# Altium schematic sheet DriverPCB.SchDoc
size A1
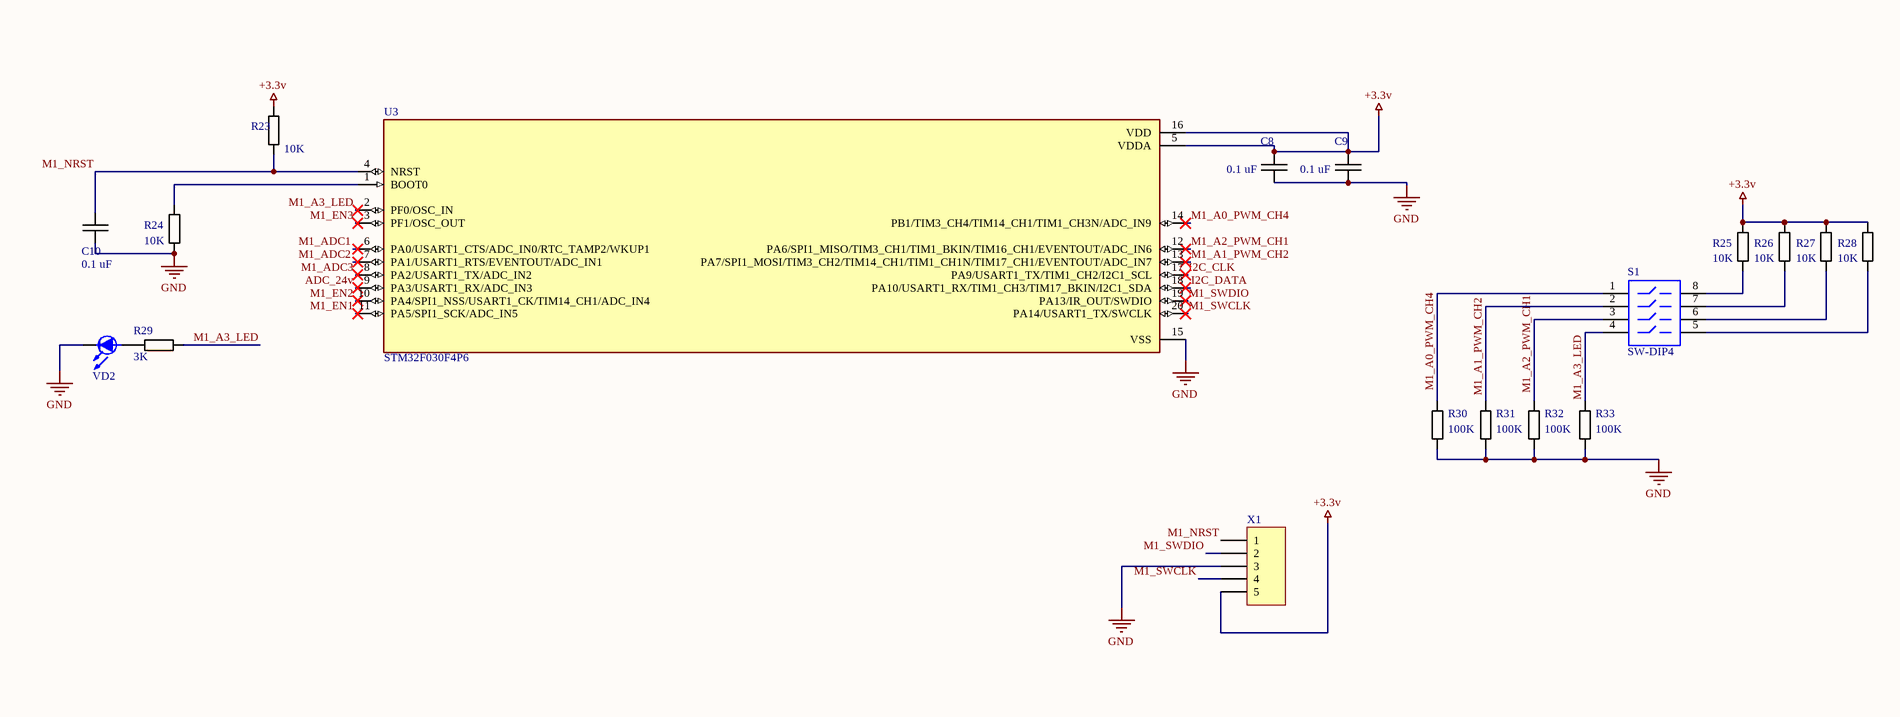
[diagram p0: DriverPCB.SchDoc, top left]
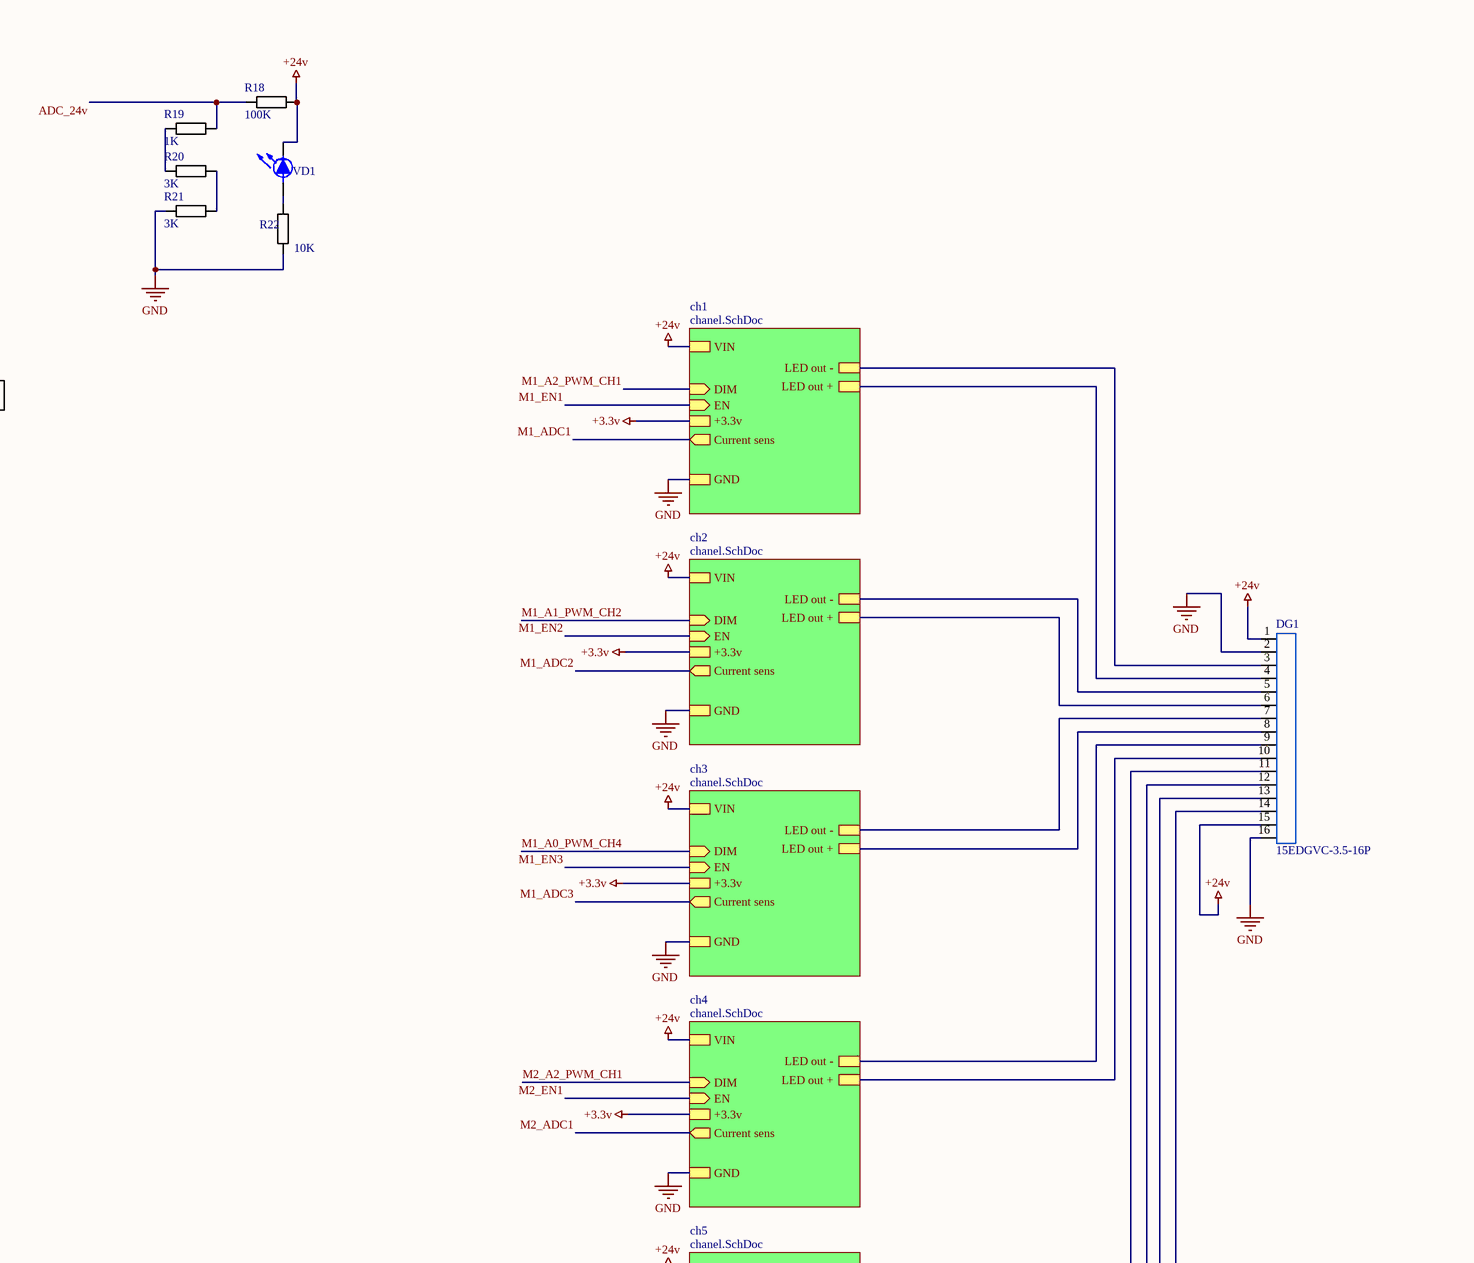
[diagram p1: DriverPCB.SchDoc, top right]
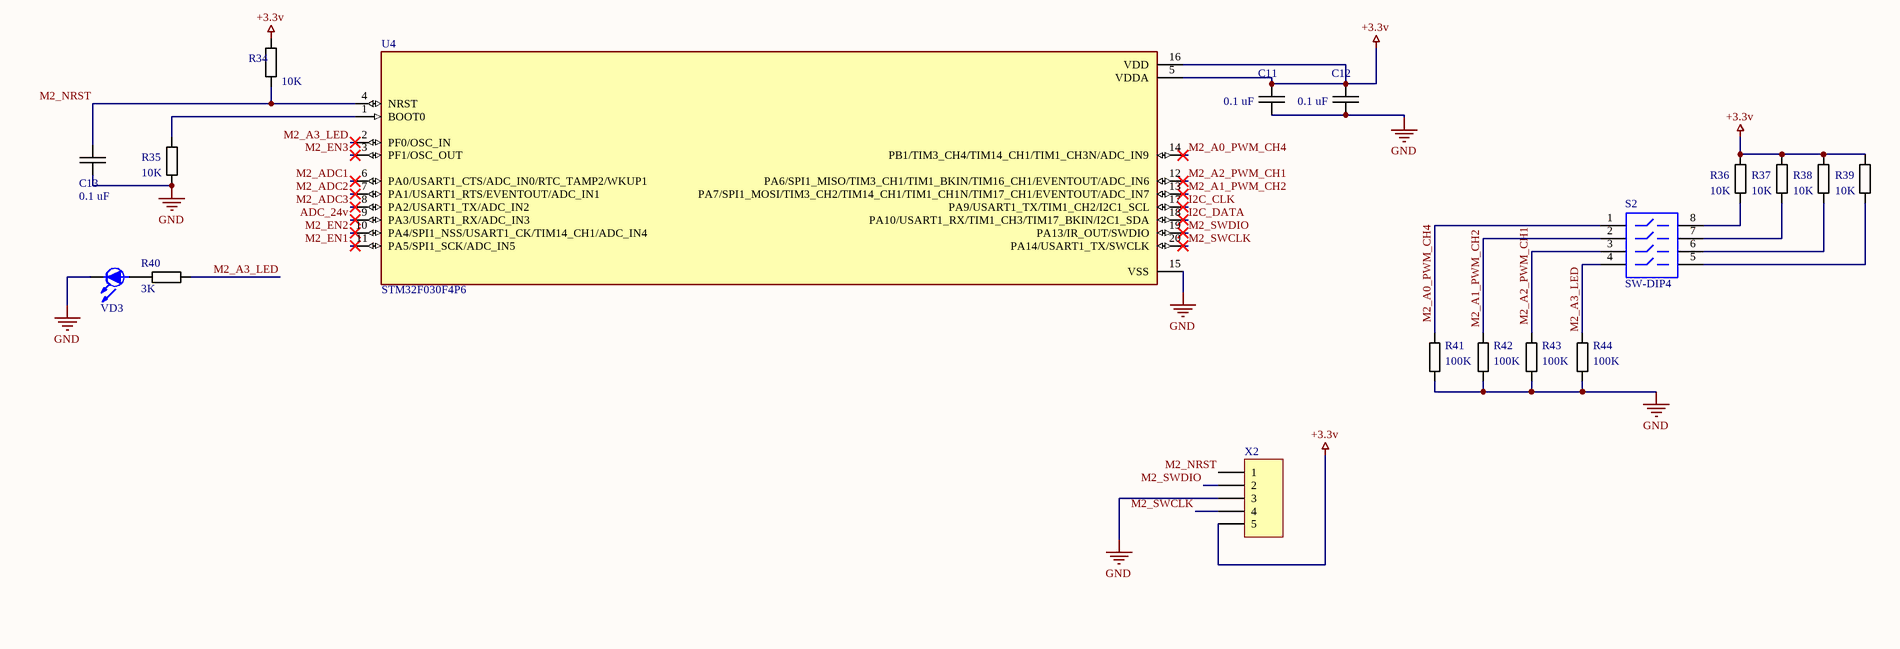
[diagram p2: DriverPCB.SchDoc, bottom left]
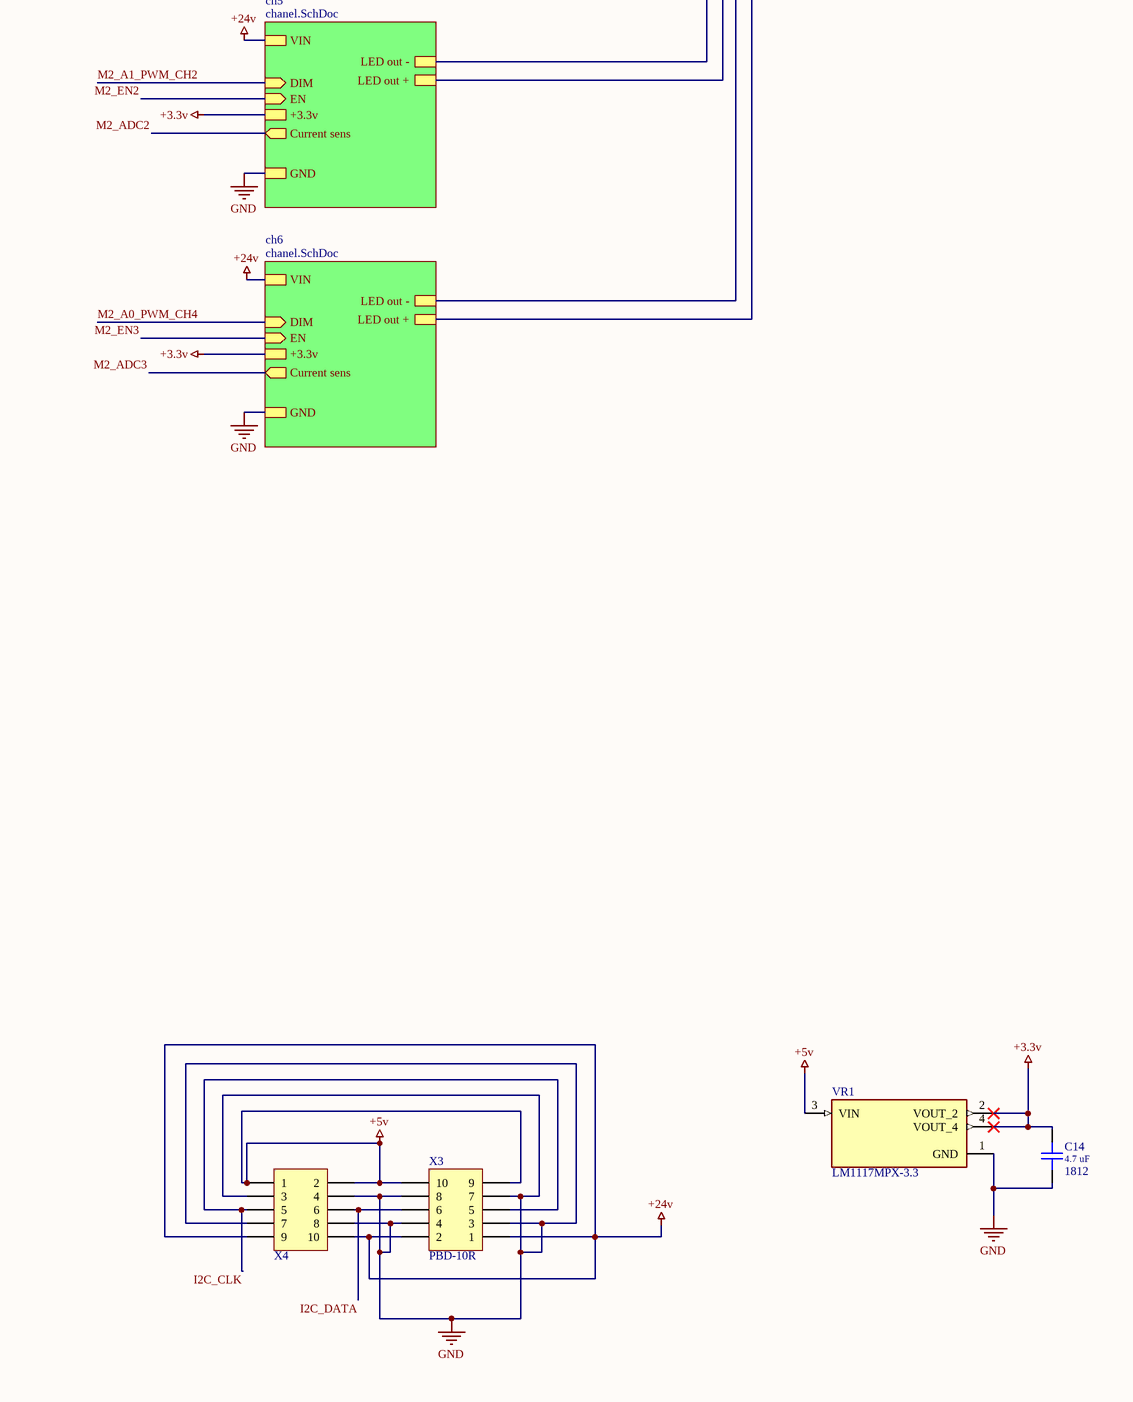
[diagram p3: DriverPCB.SchDoc, bottom right]

## Parts
C8  0.1 uF  [CAPACITOR 0603]
C9  0.1 uF  [CAPACITOR 0603]
C10  0.1 uF  [CAPACITOR 0603]
C11  0.1 uF  [CAPACITOR 0603]
C12  0.1 uF  [CAPACITOR 0603]
C13  0.1 uF  [CAPACITOR 0603]
C14  value 4.7 uF  Package: 1812  [CAPCHIP1812]  (hidden comment: Cap C)
DG1  15EDGVC-3.5-16P  [15EDGVC-3.5-16P]
R18  100K  [Resistor 0402]
R19  1K  [Resistor 0402]
R20  3K  [Resistor 0402]
R21  3K  [Resistor 0402]
R22  10K  [Resistor 0402]
R23  10K  [Resistor 0402]
R24  10K  [Resistor 0402]
R25  10K  [Resistor 0402]
R26  10K  [Resistor 0402]
R27  10K  [Resistor 0402]
R28  10K  [Resistor 0402]
R29  3K  [Resistor 0402]
R30  100K  [Resistor 0402]
R31  100K  [Resistor 0402]
R32  100K  [Resistor 0402]
R33  100K  [Resistor 0402]
R34  10K  [Resistor 0402]
R35  10K  [Resistor 0402]
R36  10K  [Resistor 0402]
R37  10K  [Resistor 0402]
R38  10K  [Resistor 0402]
R39  10K  [Resistor 0402]
R40  3K  [Resistor 0402]
R41  100K  [Resistor 0402]
R42  100K  [Resistor 0402]
R43  100K  [Resistor 0402]
R44  100K  [Resistor 0402]
S1  SW-DIP4  [DIP-8]
S2  SW-DIP4  [DIP-8]
U3  STM32F030F4P6  [SOP65P640X120-20N]
U4  STM32F030F4P6  [SOP65P640X120-20N]
VD1  one color  [0805-]  (value not drawn)
VD2  (no value)  [0805-]
VD3  (no value)  [0805-]
VR1  LM1117MPX-3.3  [VREG_LM1117MPX-3.3]
X1  (no value)  [PLS-5-3D]
X2  (no value)  [PLS-5-3D]
X3  PBD-10R  [PBD-10RR]
X4  PLD-10R  [PLD-10RR1]  (value not drawn)

## Sub-sheets
ch1 = chanel.SchDoc: VIN, GND, LED out +, LED out -, DIM (in), EN (in), +3.3v, Current sens (out)
ch2 = chanel.SchDoc: VIN, GND, LED out +, LED out -, DIM (in), EN (in), +3.3v, Current sens (out)
ch3 = chanel.SchDoc: VIN, GND, LED out +, LED out -, DIM (in), EN (in), +3.3v, Current sens (out)
ch4 = chanel.SchDoc: VIN, GND, LED out +, LED out -, DIM (in), EN (in), +3.3v, Current sens (out)
ch5 = chanel.SchDoc: VIN, GND, LED out +, LED out -, DIM (in), EN (in), +3.3v, Current sens (out)
ch6 = chanel.SchDoc: VIN, GND, LED out +, LED out -, DIM (in), EN (in), +3.3v, Current sens (out)

## Nets
+3.3v: C8.1 C9.1 C11.1 C12.1 C14.2 R23.2 R25.1 R26.1 R27.1 R28.1 R34.2 R36.1 R37.1 R38.1 R39.1 U3.5(VDDA) U3.16(VDD) U4.5(VDDA) U4.16(VDD) VR1.2(VOUT_2) VR1.4(VOUT_4) X1.5 X2.5 ; sheet ch1/+3.3v, sheet ch2/+3.3v, sheet ch3/+3.3v, sheet ch4/+3.3v, sheet ch5/+3.3v, sheet ch6/+3.3v
+5v: VR1.3(VIN) X3.9 X3.10 X4.1 X4.2
+24v: DG1.1 DG1.15 R18.1 VD1.K(k) X3.1 X3.2 X4.9 X4.10 ; sheet ch1/VIN, sheet ch2/VIN, sheet ch3/VIN, sheet ch4/VIN, sheet ch5/VIN, sheet ch6/VIN
GND: C8.2 C9.2 C10.1 C11.2 C12.2 C13.1 C14.1 DG1.2 DG1.16 R21.1 R22.1 R24.2 R30.2 R31.2 R32.2 R33.2 R35.2 R41.2 R42.2 R43.2 R44.2 U3.15(VSS) U4.15(VSS) VD2.K(k) VD3.K(k) VR1.1(GND) X1.3 X2.3 X3.3 X3.4 X3.7 X3.8 X4.3 X4.4 X4.7 X4.8 ; sheet ch1/GND, sheet ch2/GND, sheet ch3/GND, sheet ch4/GND, sheet ch5/GND, sheet ch6/GND
ADC_24v: R18.2 R19.2 U3.9(PA3/USART1_RX/ADC_IN3) U4.9(PA3/USART1_RX/ADC_IN3)
I2C_CLK: U3.17(PA9/USART1_TX/TIM1_CH2/I2C1_SCL) U4.17(PA9/USART1_TX/TIM1_CH2/I2C1_SCL) X3.5 X4.5
I2C_DATA: U3.18(PA10/USART1_RX/TIM1_CH3/TIM17_BKIN/I2C1_SDA) U4.18(PA10/USART1_RX/TIM1_CH3/TIM17_BKIN/I2C1_SDA) X3.6 X4.6
M1_A0_PWM_CH4: R30.1 S1.1 U3.14(PB1/TIM3_CH4/TIM14_CH1/TIM1_CH3N/ADC_IN9) ; sheet ch3/DIM
M1_A1_PWM_CH2: R31.1 S1.2 U3.13(PA7/SPI1_MOSI/TIM3_CH2/TIM14_CH1/TIM1_CH1N/TIM17_CH1/EVENTOUT/ADC_IN7) ; sheet ch2/DIM
M1_A2_PWM_CH1: R32.1 S1.3 U3.12(PA6/SPI1_MISO/TIM3_CH1/TIM1_BKIN/TIM16_CH1/EVENTOUT/ADC_IN6) ; sheet ch1/DIM
M1_A3_LED: R29.1 R33.1 S1.4 U3.2(PF0/OSC_IN)
M1_ADC1: U3.6(PA0/USART1_CTS/ADC_IN0/RTC_TAMP2/WKUP1) ; sheet ch1/Current sens
M1_ADC2: U3.7(PA1/USART1_RTS/EVENTOUT/ADC_IN1) ; sheet ch2/Current sens
M1_ADC3: U3.8(PA2/USART1_TX/ADC_IN2) ; sheet ch3/Current sens
M1_EN1: U3.11(PA5/SPI1_SCK/ADC_IN5) ; sheet ch1/EN
M1_EN2: U3.10(PA4/SPI1_NSS/USART1_CK/TIM14_CH1/ADC_IN4) ; sheet ch2/EN
M1_EN3: U3.3(PF1/OSC_OUT) ; sheet ch3/EN
M1_NRST: C10.2 R23.1 U3.4(NRST) X1.1
M1_SWCLK: U3.20(PA14/USART1_TX/SWCLK) X1.4
M1_SWDIO: U3.19(PA13/IR_OUT/SWDIO) X1.2
M2_A0_PWM_CH4: R41.1 S2.1 U4.14(PB1/TIM3_CH4/TIM14_CH1/TIM1_CH3N/ADC_IN9) ; sheet ch6/DIM
M2_A1_PWM_CH2: R42.1 S2.2 U4.13(PA7/SPI1_MOSI/TIM3_CH2/TIM14_CH1/TIM1_CH1N/TIM17_CH1/EVENTOUT/ADC_IN7) ; sheet ch5/DIM
M2_A2_PWM_CH1: R43.1 S2.3 U4.12(PA6/SPI1_MISO/TIM3_CH1/TIM1_BKIN/TIM16_CH1/EVENTOUT/ADC_IN6) ; sheet ch4/DIM
M2_A3_LED: R40.1 R44.1 S2.4 U4.2(PF0/OSC_IN)
M2_ADC1: U4.6(PA0/USART1_CTS/ADC_IN0/RTC_TAMP2/WKUP1) ; sheet ch4/Current sens
M2_ADC2: U4.7(PA1/USART1_RTS/EVENTOUT/ADC_IN1) ; sheet ch5/Current sens
M2_ADC3: U4.8(PA2/USART1_TX/ADC_IN2) ; sheet ch6/Current sens
M2_EN1: U4.11(PA5/SPI1_SCK/ADC_IN5) ; sheet ch4/EN
M2_EN2: U4.10(PA4/SPI1_NSS/USART1_CK/TIM14_CH1/ADC_IN4) ; sheet ch5/EN
M2_EN3: U4.3(PF1/OSC_OUT) ; sheet ch6/EN
M2_NRST: C13.2 R34.1 U4.4(NRST) X2.1
M2_SWCLK: U4.20(PA14/USART1_TX/SWCLK) X2.4
M2_SWDIO: U4.19(PA13/IR_OUT/SWDIO) X2.2
NetDG1_3: DG1.3 ; sheet ch1/LED out -
NetDG1_4: DG1.4 ; sheet ch1/LED out +
NetDG1_5: DG1.5 ; sheet ch2/LED out -
NetDG1_6: DG1.6 ; sheet ch2/LED out +
NetDG1_7: DG1.7 ; sheet ch3/LED out -
NetDG1_8: DG1.8 ; sheet ch3/LED out +
NetDG1_9: DG1.9 ; sheet ch4/LED out -
NetDG1_10: DG1.10 ; sheet ch4/LED out +
NetDG1_11: DG1.11 ; sheet ch5/LED out -
NetDG1_12: DG1.12 ; sheet ch5/LED out +
NetDG1_13: DG1.13 ; sheet ch6/LED out -
NetDG1_14: DG1.14 ; sheet ch6/LED out +
NetR19_1: R19.1 R20.1
NetR20_2: R20.2 R21.2
NetR22_2: R22.2 VD1.A(a)
NetR24_1: R24.1 U3.1(BOOT0)
NetR25_2: R25.2 S1.8
NetR26_2: R26.2 S1.7
NetR27_2: R27.2 S1.6
NetR28_2: R28.2 S1.5
NetR29_2: R29.2 VD2.A(a)
NetR35_1: R35.1 U4.1(BOOT0)
NetR36_2: R36.2 S2.8
NetR37_2: R37.2 S2.7
NetR38_2: R38.2 S2.6
NetR39_2: R39.2 S2.5
NetR40_2: R40.2 VD3.A(a)

## Library data of the parts
C8-C13 = Capasitor: Value: 0.1 uF; Package: 0603
C14 = Cap C: Ceramic Capacitor; Class: Электронные компоненты; SubClass: Конденсаторы; TKE: {TKE}; Ordering_Information: {Ordering_Information}; Installation: {Installation}; Body: {Body}; Nominal_voltage_V: {Nominal_voltage_V}; Tolerance_Percent: {Tolerance_Percent}; Pins: {Pins}
R18-R44 = Resistor: Package: 0402
  R18 R30-R33 R41-R44: Value: 100K
  R19: Value: 1K
  R20 R21 R29 R40: Value: 3K
  R22-R28 R34-R39: Value: 10K
S1 S2 = SW-DIP4: DIP Switch; Published: 24-Mar-1999; LatestRevisionDate: 17-Jul-2002; LatestRevisionNote: Re-released for DXP Platform.; PackageReference: DIP-8; Publisher: Altium Limited
U3 U4 = STM32F030F4P6: MCU 32-bit STM32F ARM Cortex M0 RISC 16KB Flash 2.5V/3.3V 20-Pin TSSOP Tray; Value: *; Availability: Unavailable; Price: None; MP: STM32F030F4P6; Package: None
VD1 = LED SMD: Class: Электронные компоненты; SubClass: Светодиоды; Value: {Value}; Pitch_mm: {Pitch_mm}; Ordering_Information: {Ordering_Information}; Luminous_intensity_mcd: {Luminous_intensity_mcd}; Diameter_mm: {Diameter_mm}; Color: {Color}; Installation: {Installation}; Body: {Body}; Pins: 2
VD2 VD3 = LED SMD: Value: 0805; CompType: LED; Note: Read; Pins: 2; Package: 0805
VR1 = LM1117MPX-3.3: 800-mA 15-V linear voltage regulator; MF: Texas Instruments; Check_prices: https://www.snapeda.com/parts/LM1117MPX-3.3/Texas+Instruments/view-part/?ref=eda; Value: *; Availability: In Stock; MP: LM1117MPX-3.3; Price: None; Package: SOT-223-4 Texas Instruments; SnapEDA_Link: https://www.snapeda.com/parts/LM1117MPX-3.3/Texas+Instruments/view-part/?ref=snap; Purchase-URL: https://pricing.snapeda.com/search/part/LM1117MPX-3.3/?ref=eda
X1 X2 = PLS-5: Header, 5-Pin; CompType: connector; Note: header pins 2.54mm x 5; Package: 2.54 x 5; PartNumber: PLS-5; Pins: 5
X3 = PBD-10R: Header, 5-Pin, Dual row
X4 = PLD-10R: Header, 5-Pin, Dual row